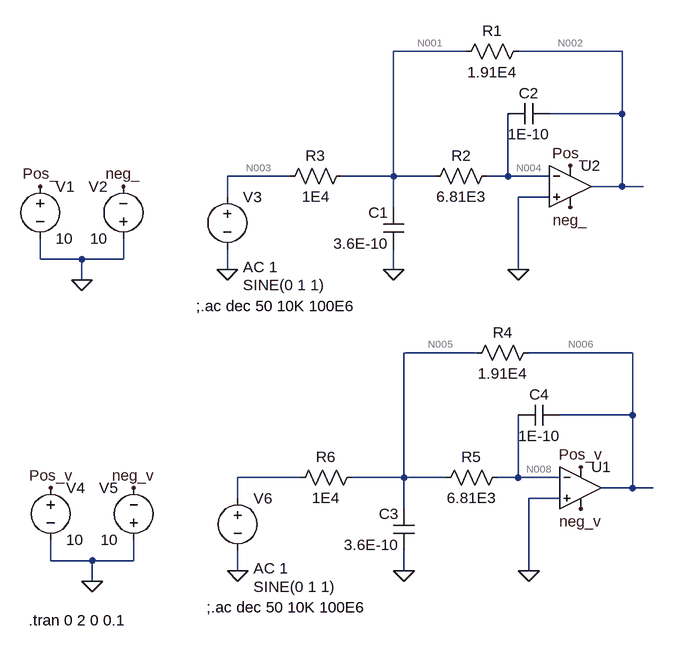
[diagram p0: schematic 2nd order E96.asc]
2nd order E96.asc, the LTspice schematic file:
Version 4
SHEET 1 880 680
WIRE 272 -992 160 -992
WIRE 512 -992 352 -992
WIRE 512 -896 512 -992
WIRE 512 -896 400 -896
WIRE 0 -800 -96 -800
WIRE 160 -800 160 -992
WIRE 160 -800 80 -800
WIRE 224 -800 160 -800
WIRE 336 -800 336 -896
WIRE 336 -800 304 -800
WIRE 400 -800 336 -800
WIRE 512 -784 512 -896
WIRE 512 -784 464 -784
WIRE 544 -784 512 -784
WIRE -96 -768 -96 -800
WIRE 400 -768 352 -768
WIRE 160 -752 160 -800
WIRE -384 -672 -384 -704
WIRE -320 -672 -384 -672
WIRE -256 -672 -256 -704
WIRE -256 -672 -320 -672
WIRE -96 -656 -96 -688
WIRE 160 -656 160 -688
WIRE 352 -656 352 -768
WIRE -320 -640 -320 -672
WIRE 288 -528 176 -528
WIRE 528 -528 368 -528
WIRE 528 -432 528 -528
WIRE 528 -432 416 -432
WIRE 16 -336 -80 -336
WIRE 176 -336 176 -528
WIRE 176 -336 96 -336
WIRE 240 -336 176 -336
WIRE 352 -336 352 -432
WIRE 352 -336 320 -336
WIRE 416 -336 352 -336
WIRE 528 -320 528 -432
WIRE 528 -320 480 -320
WIRE 560 -320 528 -320
WIRE -80 -304 -80 -336
WIRE 416 -304 368 -304
WIRE 176 -288 176 -336
WIRE -368 -208 -368 -240
WIRE -304 -208 -368 -208
WIRE -240 -208 -240 -240
WIRE -240 -208 -304 -208
WIRE -80 -192 -80 -224
WIRE 176 -192 176 -224
WIRE 368 -192 368 -304
WIRE -304 -176 -304 -208
FLAG -368 -320 Pos_v
FLAG -240 -320 neg_v
FLAG -304 -176 0
FLAG 368 -192 0
FLAG 176 -192 0
FLAG -80 -192 0
FLAG 448 -352 Pos_v
FLAG 448 -288 neg_v
FLAG -384 -784 Pos_
FLAG -256 -784 neg_
FLAG -320 -640 0
FLAG 352 -656 0
FLAG 160 -656 0
FLAG -96 -656 0
FLAG 432 -816 Pos_
FLAG 432 -752 neg_
SYMBOL voltage -368 -336 R0
WINDOW 123 0 0 Left 0
WINDOW 39 0 0 Left 0
SYMATTR InstName V4
SYMATTR Value 10
SYMBOL voltage -240 -224 R180
WINDOW 0 24 96 Left 2
WINDOW 3 24 16 Left 2
SYMATTR InstName V5
SYMATTR Value 10
SYMBOL res 384 -544 R90
WINDOW 0 0 56 VBottom 2
WINDOW 3 32 56 VTop 2
SYMATTR InstName R4
SYMATTR Value 1.91E4
SYMBOL res 336 -352 R90
WINDOW 0 0 56 VBottom 2
WINDOW 3 32 56 VTop 2
SYMATTR InstName R5
SYMATTR Value 6.81E3
SYMBOL res 112 -352 R90
WINDOW 0 0 56 VBottom 2
WINDOW 3 32 56 VTop 2
SYMATTR InstName R6
SYMATTR Value 1E4
SYMBOL cap 192 -224 R180
WINDOW 0 24 56 Left 2
WINDOW 3 24 8 Left 2
SYMATTR InstName C3
SYMATTR Value 3.6E-10
SYMBOL cap 352 -416 R270
WINDOW 0 32 32 VTop 2
WINDOW 3 0 32 VBottom 2
SYMATTR InstName C4
SYMATTR Value 1E-10
SYMBOL voltage -80 -320 R0
WINDOW 123 24 124 Left 2
WINDOW 39 0 0 Left 0
WINDOW 3 24 152 Left 2
SYMATTR Value2 AC 1
SYMATTR InstName V6
SYMATTR Value SINE(0 1 1)
SYMBOL Opamps\\UniversalOpamp2 448 -320 R0
SYMATTR InstName U1
SYMATTR Value2 Avol=1Meg GBW=4Meg Slew=10Meg
SYMATTR SpiceLine ilimit=25m rail=0 Vos=0.001 phimargin=45
SYMBOL voltage -384 -800 R0
WINDOW 123 0 0 Left 0
WINDOW 39 0 0 Left 0
SYMATTR InstName V1
SYMATTR Value 10
SYMBOL voltage -256 -688 R180
WINDOW 0 24 96 Left 2
WINDOW 3 24 16 Left 2
SYMATTR InstName V2
SYMATTR Value 10
SYMBOL res 368 -1008 R90
WINDOW 0 0 56 VBottom 2
WINDOW 3 32 56 VTop 2
SYMATTR InstName R1
SYMATTR Value 1.91E4
SYMBOL res 320 -816 R90
WINDOW 0 0 56 VBottom 2
WINDOW 3 32 56 VTop 2
SYMATTR InstName R2
SYMATTR Value 6.81E3
SYMBOL res 96 -816 R90
WINDOW 0 0 56 VBottom 2
WINDOW 3 32 56 VTop 2
SYMATTR InstName R3
SYMATTR Value 1E4
SYMBOL cap 176 -688 R180
WINDOW 0 24 56 Left 2
WINDOW 3 24 8 Left 2
SYMATTR InstName C1
SYMATTR Value 3.6E-10
SYMBOL cap 336 -880 R270
WINDOW 0 32 32 VTop 2
WINDOW 3 0 32 VBottom 2
SYMATTR InstName C2
SYMATTR Value 1E-10
SYMBOL voltage -96 -784 R0
WINDOW 123 24 124 Left 2
WINDOW 39 0 0 Left 0
WINDOW 3 24 152 Left 2
SYMATTR Value2 AC 1
SYMATTR InstName V3
SYMATTR Value SINE(0 1 1)
SYMBOL Opamps\\UniversalOpamp2 432 -784 R0
SYMATTR InstName U2
SYMATTR Value2 Avol=1Meg GBW=4Meg Slew=10Meg
TEXT -128 -136 Left 2 !;.ac dec 50 10K 100E6
TEXT -402 -116 Left 2 !.tran 0 2 0 0.1
TEXT -144 -600 Left 2 !;.ac dec 50 10K 100E6

The netlist it stands for:
* 2nd order E96.asc
V4 Pos_v 0 10
V5 0 neg_v 10
R4 N006 N005 1.91E4
R5 N008 N005 6.81E3
R6 N005 N007 1E4
C3 0 N005 3.6E-10
C4 N008 N006 1E-10
V6 N007 0 SINE(0 1 1) AC 1
XU1 0 N008 Pos_v neg_v N006 level.2 Avol=1Meg GBW=4Meg Slew=10Meg ilimit=25m rail=0 Vos=0.001 phimargin=45 en=0 enk=0 in=0 ink=0 Rin=500Meg  ; pins IN+ IN- V+ V- OUT
V1 Pos_ 0 10
V2 0 neg_ 10
R1 N002 N001 1.91E4
R2 N004 N001 6.81E3
R3 N001 N003 1E4
C1 0 N001 3.6E-10
C2 N004 N002 1E-10
V3 N003 0 SINE(0 1 1) AC 1
XU2 0 N004 Pos_ neg_ N002 level.2 Avol=1Meg GBW=4Meg Slew=10Meg ilimit=25m rail=0 Vos=0 phimargin=45 en=0 enk=0 in=0 ink=0 Rin=500Meg  ; pins IN+ IN- V+ V- OUT
;.ac dec 50 10K 100E6
.tran 0 2 0 0.1
;.ac dec 50 10K 100E6
.lib UniversalOpamps2.sub
.backanno
.end

* Results of the author's LTspice run, read from the files saved beside the schematic
* Operating Point, zero values left out:
*   V(pos_v) = 10 V
*   V(neg_v) = -10 V
*   V(n006) = 2.91 mV
*   V(n005) = 1 mV
*   V(n008) = 1 mV
*   V(pos_) = 10 V
*   V(neg_) = -10 V
*   I(R6) = 100 nA
*   I(R5) = -2 pA
*   I(R4) = 100 nA
*   I(V2) = -999.5 µA
*   I(V1) = -999.5 µA
*   I(V6) = 100 nA
*   I(V5) = -999.5 µA
*   I(V4) = -999.6 µA
*   Ix(u1:2) = 2 pA
*   Ix(u1:3) = 999.6 µA
*   Ix(u1:4) = -999.5 µA
*   Ix(u1:5) = -100 nA
*   Ix(u2:3) = 999.5 µA
*   Ix(u2:4) = -999.5 µA
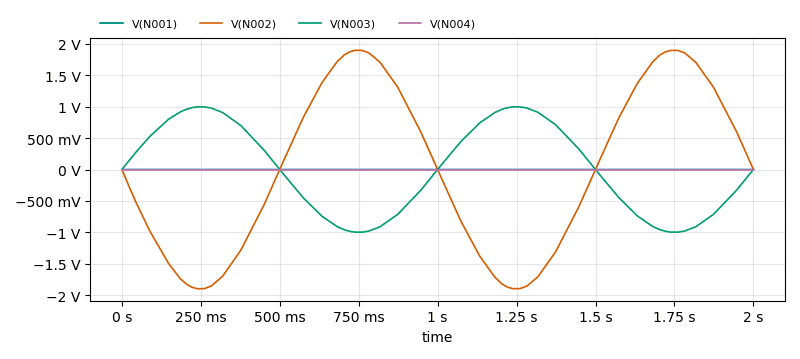
[diagram p1: Transient Analysis of 2nd order E96.asc, plotted from the saved traces]
* Transient Analysis, 1 run:
*   V(N001): min -8.548 µV, max 8.819 µV, average 17.67 nV, rms 6.111 µV, last 8.752 µV
*   V(N002): min -1.899 V, max 1.897 V, average -645.4 µV, rms 1.335 V, last 48.66 µV
*   V(N003): min -997.8 mV, max 998.1 mV, average 83.75 µV, rms 711.1 mV, last 0 V
*   V(N004): min -1.966 µV, max 1.967 µV, average 1.589 nV, rms 1.382 µV, last 484.4 nV